# Altium schematic sheet MC10EP51.SchDoc
size A4; SheetNumber: 21; SheetTotal: 33
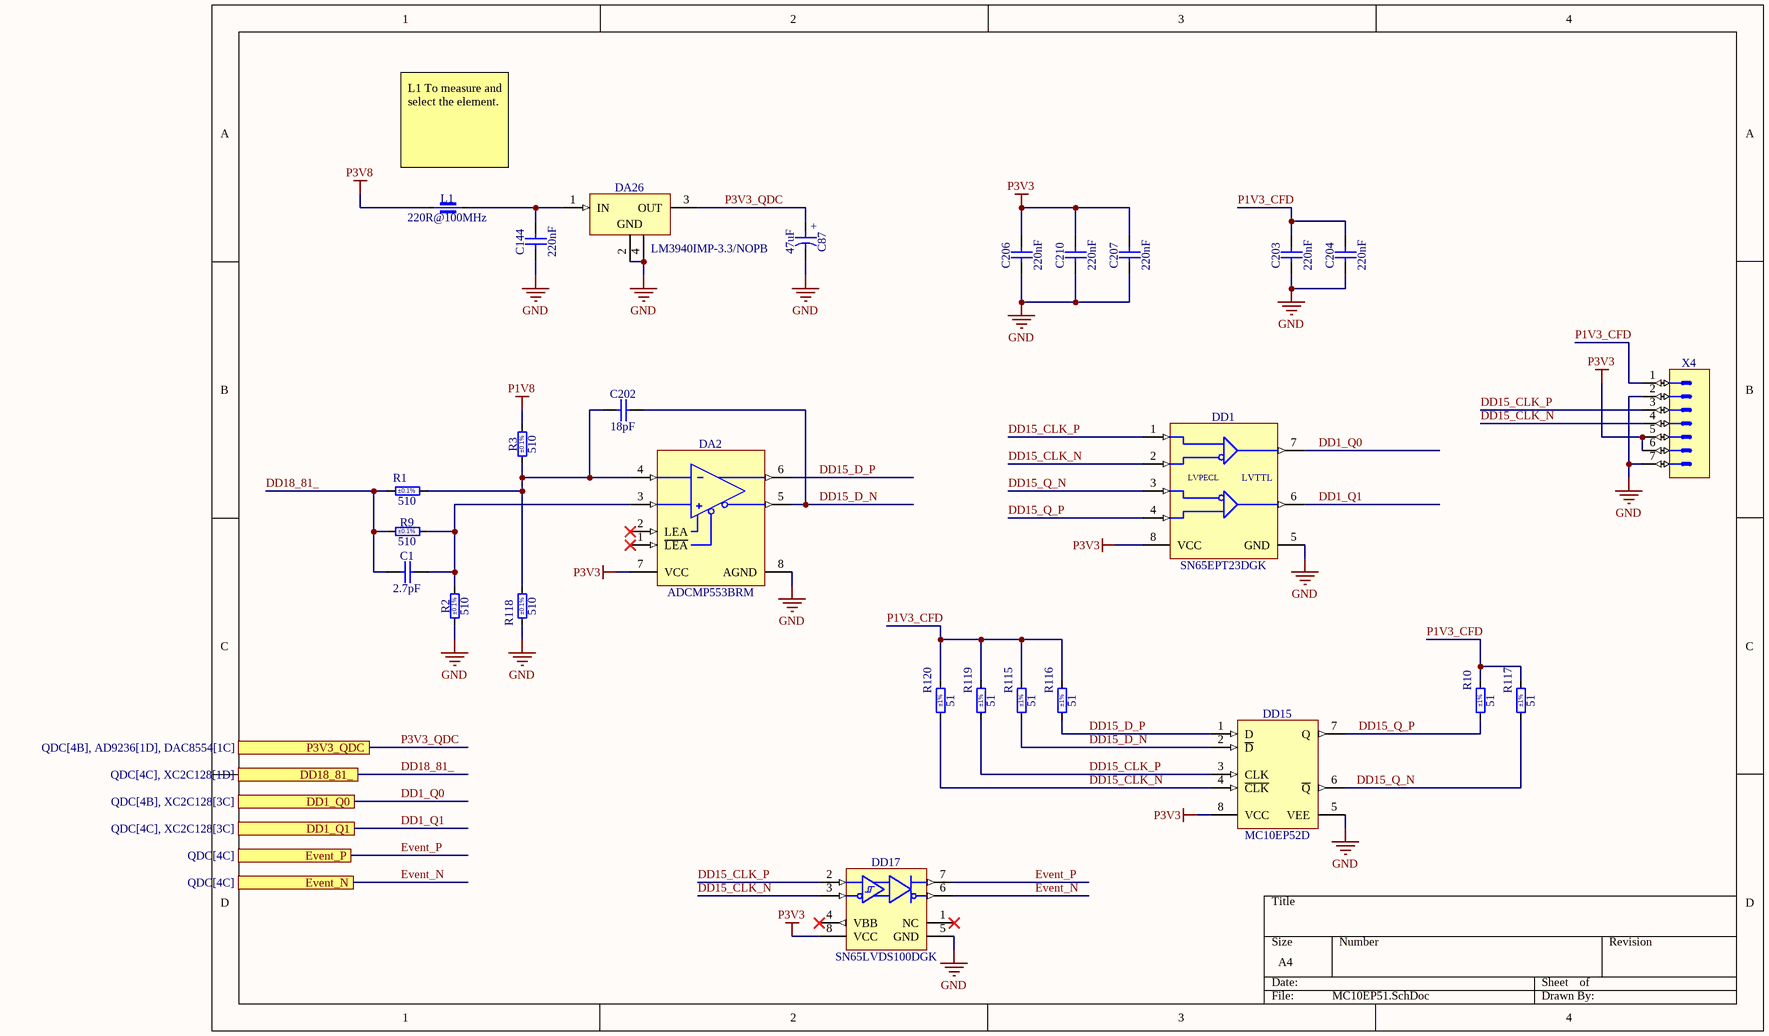
[diagram p0: MC10EP51.SchDoc]

## Parts
C1  2.7pF  [CAPC2012X135N]
C87  47uF  [CAPAE530X610N]
C144  220nF  [CAPC2012X135N]
C202  18pF  [CAPC2012X88N]
C203  220nF  [CAPC2012X135N]
C204  220nF  [CAPC2012X135N]
C206  220nF  [CAPC2012X135N]
C207  220nF  [CAPC2012X135N]
C210  220nF  [CAPC2012X135N]
DA2  ADCMP553BRM  [SOP65P490X110-8N]
DA26  LM3940IMP-3.3/NOPB  [SOT230P700X180-4N]
DD1  SN65EPT23DGK  [SOP65P490X110-8N]
DD15  MC10EP52D  [SOIC127P600X175-8N]
DD17  SN65LVDS100DGK  [SOP65P490X110-8N]
L1  220R@100MHz  [INDC2012X105N]
R1  510  Tolerance: ±0.1%  [RESC2012X60N]
R2  510  Tolerance: ±0.1%  [RESC2012X60N]
R3  510  Tolerance: ±0.1%  [RESC2012X60N]
R9  510  Tolerance: ±0.1%  [RESC2012X60N]
R10  51  Tolerance: ±1%  [RESC2012X60N]
R115  51  Tolerance: ±1%  [RESC2012X60N]
R116  51  Tolerance: ±1%  [RESC2012X60N]
R117  51  Tolerance: ±1%  [RESC2012X60N]
R118  510  Tolerance: ±0.1%  [RESC2012X60N]
R119  51  Tolerance: ±1%  [RESC2012X60N]
R120  51  Tolerance: ±1%  [RESC2012X60N]
X4  Header 7  [SAMTEC_DW-07-09-L-S-470]  (value not drawn)

## Ports
DD1_Q0 (see QDC[4B], XC2C128[3C]), DD1_Q1 (see QDC[4C], XC2C128[3C]), DD18_81_ (see QDC[4C], XC2C128[1D]), Event_N (see QDC[4C]), Event_P (see QDC[4C]), P3V3_QDC (see QDC[4B], AD9236[1D], DAC8554[1C])

## Nets
GND: C87.2 C144.1 C203.1 C204.1 C206.1 C207.1 C210.1 DA2.8(AGND) DA26.2(GND) DA26.4(GND) DD1.5(GND) DD15.5(VEE) DD17.5(GND) R2.1 R118.1 X4.2 X4.7
P1V8: R3.2
P3V3: C206.2 C207.2 C210.2 DA2.7(VCC) DD1.8(VCC) DD15.8(VCC) DD17.8(VCC) X4.5 X4.6
P3V8: L1.1
DD1_Q0: DD1.7(Q0) ; port DD1_Q0
DD1_Q1: DD1.6(Q1) ; port DD1_Q1
DD15_CLK_N: DD1.2(~{D0}) DD15.4(~{CLK}) DD17.3(B) R120.1 X4.4
DD15_CLK_P: DD1.1(D0) DD15.3(CLK) DD17.2(A) R119.1 X4.3
DD15_D_N: C202.2 DA2.5(~{QA}) DD15.2(~{D}) R115.1
DD15_D_P: DA2.6(QA) DD15.1(D) R116.1
DD15_Q_N: DD1.3(~{D1}) DD15.6(~{Q}) R117.1
DD15_Q_P: DD1.4(D1) DD15.7(Q) R10.1
DD18_81_: C1.1 R1.1 R9.1 ; port DD18_81_
Event_N: DD17.6(Z) ; port Event_N
Event_P: DD17.7(Y) ; port Event_P
P1V3_CFD: C203.2 C204.2 R10.2 R115.2 R116.2 R117.2 R119.2 R120.2 X4.1
P3V3_QDC: C87.1 DA26.3(OUT) ; port P3V3_QDC
NetC1_2: C1.2 DA2.3(+INA) R2.2 R9.2
NetC144_2: C144.2 DA26.1(IN) L1.2
NetC202_1: C202.1 DA2.4(-INA) R1.2 R3.1 R118.2

Not connected (* = marked no-connect by the designer): DA2 1(~{LEA})* 2(LEA)*; DD17 1(NC)* 4(VBB)*

## Notes on the sheet
- (near L1) L1 To measure and select the element.
- (in symbol CAE530-610_47UF_16V_20%) +
- (in symbol SN65EPT23DGK) LVPECL; LVTTL

## Library data of the parts
C1 = CC0805_2.7PF_250V_0.05PF_NP0: Non-polarised capacitor; Part Description: SMD Multilayer Chip Ceramic Capacitor; Manufacturer: GENERIC; Manufacturer1 Part Number: 600F2R7AT250XT; Voltage: 50V; TC: C0G/NP0; Tolerance: ±0.05pF; Part Number: CC0805_2.7PF_250V_0.05PF_NP0; Component Kind: Standard; Component Type: Standard; Pin Count: 2; Value: 2.7pF; Status: None; Manufacturer Part Number: CC0805_2.7PF_250V_0.05PF_NP0; Case: 0805; Mounted: Yes; Socket: No; SMD: Yes; Sense: No; Manufacturer1 Example: AVX; Manufacturer1 ComponentHeight: 1.30mm; HelpURL: \\cern.ch\dfs\Applications\Altium\Datasheets\CC0805_NP0_AVX(MLC).pdf; Author: CERN DEM HF; CreateDate: 07.05.2024; LatestRevisionDate: 07.05.2024
C87 = CAE530-610_47UF_16V_20%: Polarised capacitor; Part Description: Conductive Polymer Hybrid Aluminum Electrolytic Capacitor; Manufacturer: CHEMI-CON; Manufacturer Part Number: HHXD160ARA470ME61G; Voltage: 16V; Tolerance: ±20%; Part Number: CAE530-610_47UF_16V_20%; Component Kind: Standard; Component Type: Standard; Pin Count: 2; Value: 47uF; Status: Not Recommended; Case: C; Mounted: Yes; Socket: No; SMD: Yes; Sense: No; ComponentHeight: 6.1mm; HelpURL: \\cern.ch\dfs\Applications\Altium\Datasheets\CAE_CHIMI-CON_HXD.pdf; Author: CERN DEM HF; CreateDate: 15.04.2024; LatestRevisionDate: 15.04.2024
C144 C203 C204 C206 C207 C210 = CC0805_220NF_50V_10%_X7R: Non-polarised capacitor; Part Description: SMD Multilayer Chip Ceramic Capacitor; Manufacturer: GENERIC; Manufacturer1 Part Number: GRM21BR71H224KA01L; Voltage: 50V; TC: X7R; Tolerance: ±10%; Part Number: CC0805_220NF_50V_10%_X7R; Component Kind: Standard; Component Type: Standard; Pin Count: 2; Value: 220nF; Status: Preferred; Manufacturer Part Number: CC0805_220NF_50V_10%_X7R; Case: 0805; Mounted: Yes; Socket: No; SMD: Yes; Sense: No; Manufacturer1 Example: MURATA; Manufacturer1 ComponentHeight: 1.35mm; HelpURL: \\cern.ch\dfs\Applications\Altium\Datasheets\CC0805_X7R_MURATA.pdf; Author: CERN DEM JLC; CreateDate: 03.12.2007; LatestRevisionDate: 03.12.2007
C202 = CC0805_18PF_50V_1%_C0G: Non-polarised capacitor; Part Description: SMD Multilayer Chip Ceramic Capacitor; Manufacturer: GENERIC; Manufacturer1 Part Number: C0805C180F5GACTU; Voltage: 50V; TC: C0G/NP0; Tolerance: ±1%; Part Number: CC0805_18PF_50V_1%_C0G; Component Kind: Standard; Component Type: Standard; Pin Count: 2; Value: 18pF; Status: None; Manufacturer Part Number: CC0805_18PF_50V_1%_C0G; Case: 0805; Mounted: Yes; Socket: No; SMD: Yes; Sense: No; Manufacturer1 Example: KEMET; Manufacturer1 ComponentHeight: 0.88mm; HelpURL: \\cern.ch\dfs\Applications\Altium\Datasheets\CC0805_C0G_KEMET_(Commercial Grade).pdf; Author: CERN DEM JLC; CreateDate: 27.01.2015; LatestRevisionDate: 27.01.2015
DA2 = ADCMP553BRM: Single-Supply, High Speed PECL/LVPECL Comparators; Part Description: Single-Supply, High Speed, PECL/LVPECL Comparators; Manufacturer: ANALOG DEVICES; PressFit: No; Bonding: No; Part Number: ADCMP553BRM; Component Kind: Standard; Component Type: Standard; Device: ADCMP553BRM; PackageDescription: SOP, 0.65mm Pitch; 8 Pin, 3.00mm W X 3.00mm L X 1.10mm H body, IPC Medium Density; Manufacturer Part Number: ADCMP553BRM; Pin Count: 8; Case: MSOP8; Mounted: Yes; Socket: No; SMD: Yes; Sense: No; ComponentHeight: 1.1mm; Author: CERN DEM HF; HelpURL: \\cern.ch\dfs\Applications\Altium\Datasheets\ADCMP553.pdf; CreateDate: 06.05.2024; LatestRevisionDate: 06.05.2024
DA26 = LM3940IMP-3.3/NOPB: 3-Terminal Regulator 1=IN 2=GND 3=OUT 4=GND; Part Description: 1A Low Dropout Regulator for 5V to 3.3V Conversion; Manufacturer: TEXAS INSTRUMENTS; PressFit: No; Bonding: No; Part Number: LM3940IMP-3.3/NOPB; Component Kind: Standard; Component Type: Standard; Device: LM3940IMP-3.3/NOPB; PackageDescription: SOT223, 2.30mm Pitch; 4 Pin, 3.70mm W X 6.70mm L X 1.80mm H body, IPC Medium Density; Manufacturer Part Number: LM3940IMP-3.3; Pin Count: 4; Case: SOT223; Mounted: Yes; Socket: No; SMD: Yes; Sense: No; ComponentHeight: 1.8mm; HelpURL: \\cern.ch\dfs\Applications\Altium\Datasheets\LM3940IMP-3.3-NOPB.pdf; Author: CERN DEM JLC; CreateDate: 28.03.2011; LatestRevisionDate: 01.06.2022
DD1 = SN65EPT23DGK: 5V PECL to TTL Translator; Part Description: 3.3V ECL Differential LVPECL/LVDS to LVTTL/LVCMOS Translator; Manufacturer: TEXAS INSTRUMENTS; PressFit: No; Bonding: No; Part Number: SN65EPT23DGK; Component Kind: Standard; Component Type: Standard; Device: SN65EPT23DGK; PackageDescription: SOP, 0.65mm Pitch; 8 Pin, 3.00mm W X 3.00mm L X 1.10mm H body, IPC Medium Density; Manufacturer Part Number: SN65EPT23DGK; Pin Count: 8; Case: TSSOP8; Mounted: Yes; Socket: No; SMD: Yes; Sense: No; ComponentHeight: 1.1mm; Author: CERN DEM HF; HelpURL: \\cern.ch\dfs\Applications\Altium\Datasheets\SN65EPT23.pdf; CreateDate: 17.05.2024; LatestRevisionDate: 17.05.2024
DD15 = MC10EP52D: 3.3V/5V ECL Differential Data and Clock D Flip-Flop; Manufacturer: ON SEMICONDUCTOR; PressFit: No; Bonding: No; Part Number: MC10EP52D; Component Kind: Standard; Component Type: Standard; Device: MC10EP52D; PackageDescription: SOIC 8, Pitch 1.27mm - Body 4x5mm, IPC Medium Density; Part Description: 3.3V/5V ECL Differential Data and Clock D Flip-Flop; Manufacturer Part Number: MC10EP52D; Pin Count: 8; Case: SOIC8; Mounted: Yes; Socket: No; SMD: Yes; Sense: No; ComponentHeight: 1.75mm; Author: CERN DEM HF; HelpURL: \\cern.ch\dfs\Applications\Altium\Datasheets\MC10EP52D.pdf; CreateDate: 08.05.2024; LatestRevisionDate: 08.05.2024
DD17 = SN65LVDS100DGK: Differential LVDS Translator/Repeater; Part Description: 2Gbps Differential LVDS Translator/Repeater; Manufacturer: TEXAS INSTRUMENTS; PressFit: No; Bonding: No; Part Number: SN65LVDS100DGK; Component Kind: Standard; Component Type: Standard; Device: SN65LVDS100DGK; PackageDescription: SOP, 0.65mm Pitch; 8 Pin, 3.00mm W X 3.00mm L X 1.10mm H body, IPC Medium Density; Manufacturer Part Number: SN65LVDS100DGK; Pin Count: 8; Case: SSOP8; Mounted: Yes; Socket: No; SMD: Yes; Sense: No; ComponentHeight: 1.1mm; Author: CERN DEM JLC; HelpURL: \\cern.ch\dfs\Applications\Altium\Datasheets\SN65LVDS100DGK.pdf; CreateDate: 18.11.2011; LatestRevisionDate: 18.11.2011
L1 = IND0805_TDK_MPZ2012S221A: Part Description: SMT Chip Bead for General Power Line (MPZ Series); Manufacturer: TDK; Power: 3A; Resistance: 0.04R; Tolerance: ±25%; Part Number: IND0805_TDK_MPZ2012S221A; Component Kind: Standard; Component Type: Standard; Pin Count: 2; Value: 220R@100MHz; Manufacturer Part Number: MPZ2012S221A; Case: 0805; Mounted: Yes; Socket: No; SMD: Yes; Sense: No; ComponentHeight: 1.05mm; HelpURL: \\cern.ch\dfs\Applications\Altium\Datasheets\IND0805_TDK_MPZ2012.pdf; Author: CERN DEM HF; CreateDate: 04.10.2021; LatestRevisionDate: 04.10.2021
R1-R3 R9 R118 = R0805_510R_0.1%_0.125W_10PPM: Resistor - 0.1%; Part Description: Thin Film Chip Resistor; Manufacturer: GENERIC; Manufacturer1 Part Number: RT0805BRB07510RL; Power: 0.125W; TC: ±10ppm; PressFit: No; Part Number: R0805_510R_0.1%_0.125W_10PPM; Component Kind: Standard; Component Type: Standard; Pin Count: 2; Value: 510; Status: Not Recommended; Manufacturer Part Number: R0805_510R_0.1%_0.125W_10PPM; Case: 0805; Mounted: Yes; Sense: No; Socket: No; SMD: Yes; Manufacturer1 Example: YAGEO PHYCOMP; Manufacturer1 ComponentHeight: 0.6mm; HelpURL: \\cern.ch\dfs\Applications\Altium\Datasheets\R0805_YAGEO_RT.pdf; Author: CERN DEM HF; CreateDate: 11.07.2022; LatestRevisionDate: 11.07.2022
R10 R115-R117 R119 R120 = R0805_51R_1%_0.125W_100PPM: Resistor - 1%; Part Description: General Purpose Thick Film Chip Resistor; Manufacturer: GENERIC; Manufacturer1 Part Number: NRC10F51R0TRF; Power: 0.125W; TC: ±100ppm/°C; PressFit: No; Part Number: R0805_51R_1%_0.125W_100PPM; Component Kind: Standard; Component Type: Standard; Pin Count: 2; Value: 51; Status: Preferred; Manufacturer Part Number: R0805_51R_1%_0.125W_100PPM; Case: 0805; Mounted: Yes; Sense: No; Socket: No; SMD: Yes; Manufacturer1 Example: NIC COMPONENT; Manufacturer1 ComponentHeight: 0.6mm; HelpURL: \\cern.ch\dfs\Applications\Altium\Datasheets\R0805_NIC_NRC.pdf; Author: CERN DEM JLC; CreateDate: 03.12.2007; LatestRevisionDate: 13.03.2008
X4 = SAMTEC_DW-07-09-L-S-470: Connector 7 Male; Part Description: 7 Contacts, Pitch 2.54mm, Single Row Straight .Flex Stack, Flexible Board Stacker (Stacker Height = 11,938mm); Manufacturer: SAMTEC; PressFit: No; Part Number: SAMTEC_DW-07-09-L-S-470; Component Kind: Standard; Component Type: Standard; Pin Count: 7; Family: Header 7; Mounted: Yes; Socket: No; SMD: No; Sense: No; Status: None; Manufacturer Part Number: DW-07-09-L-S-470; ComponentHeight: 15.75mm; HelpURL: \\cern.ch\dfs\Applications\Altium\Datasheets\SAMTEC_DW.pdf; Author: CERN DEM HF; CreateDate: 06.06.2024; LatestRevisionDate: 06.06.2024